# EasyEDA Pro project 01_立创eda专业版_esp32语音助手-自制版_2024-07-09.epro, board PCB3_1
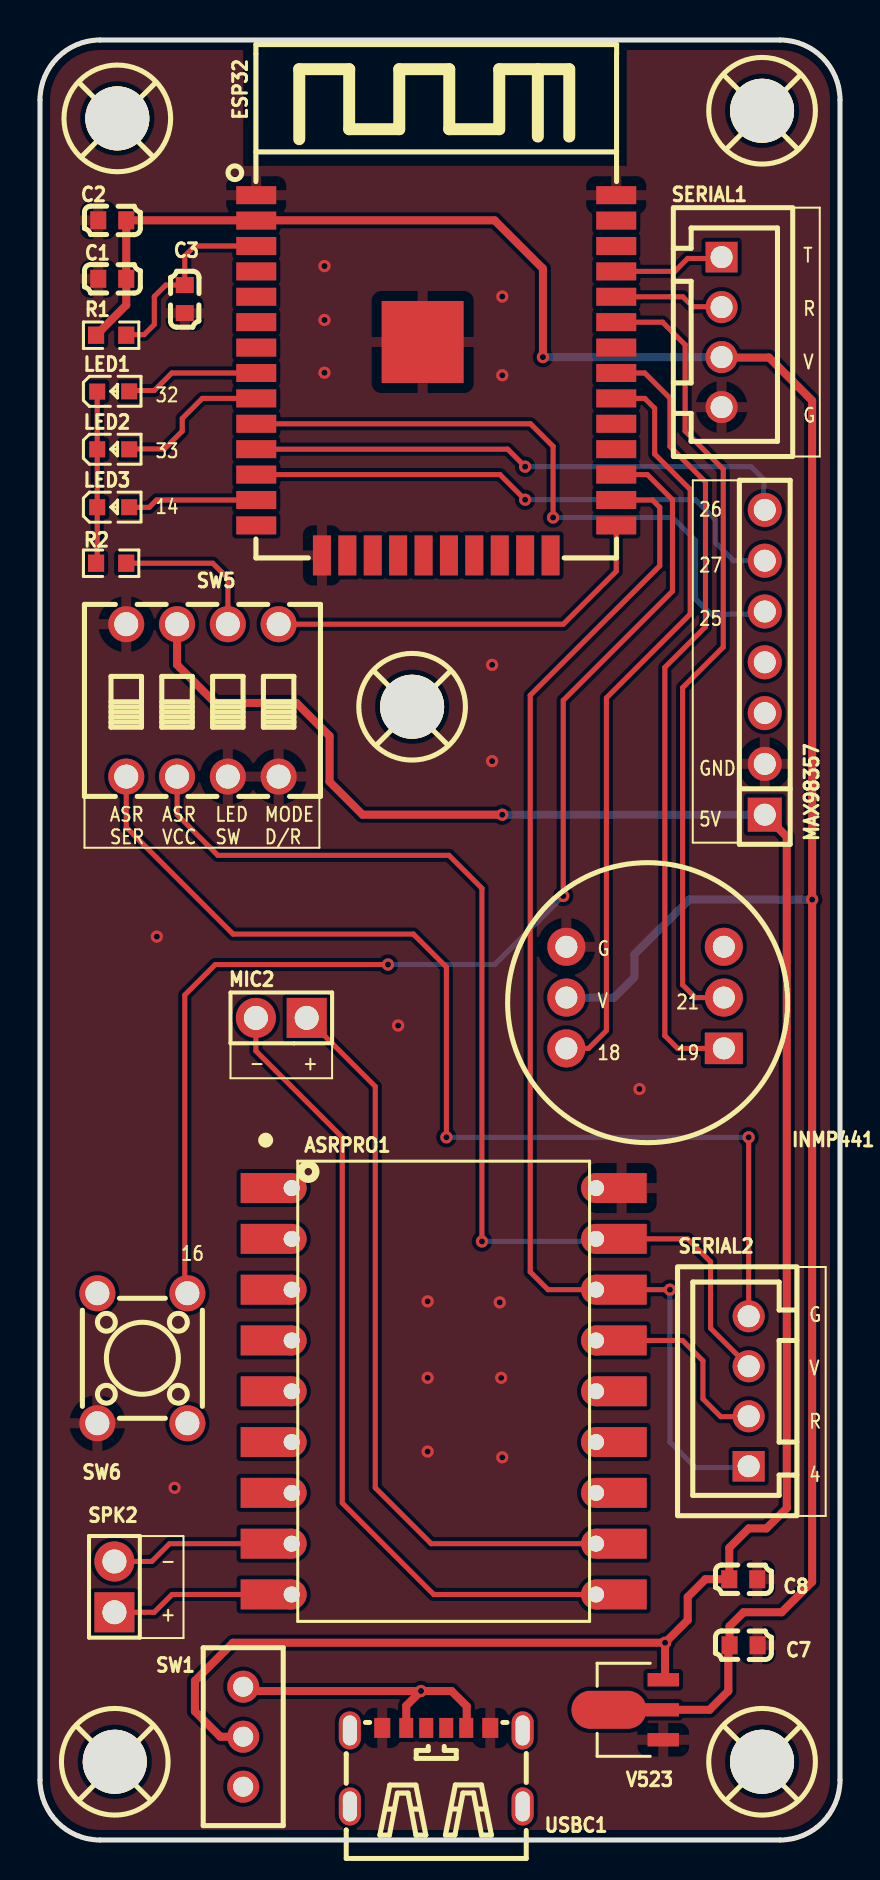
[diagram p16: board, top side]
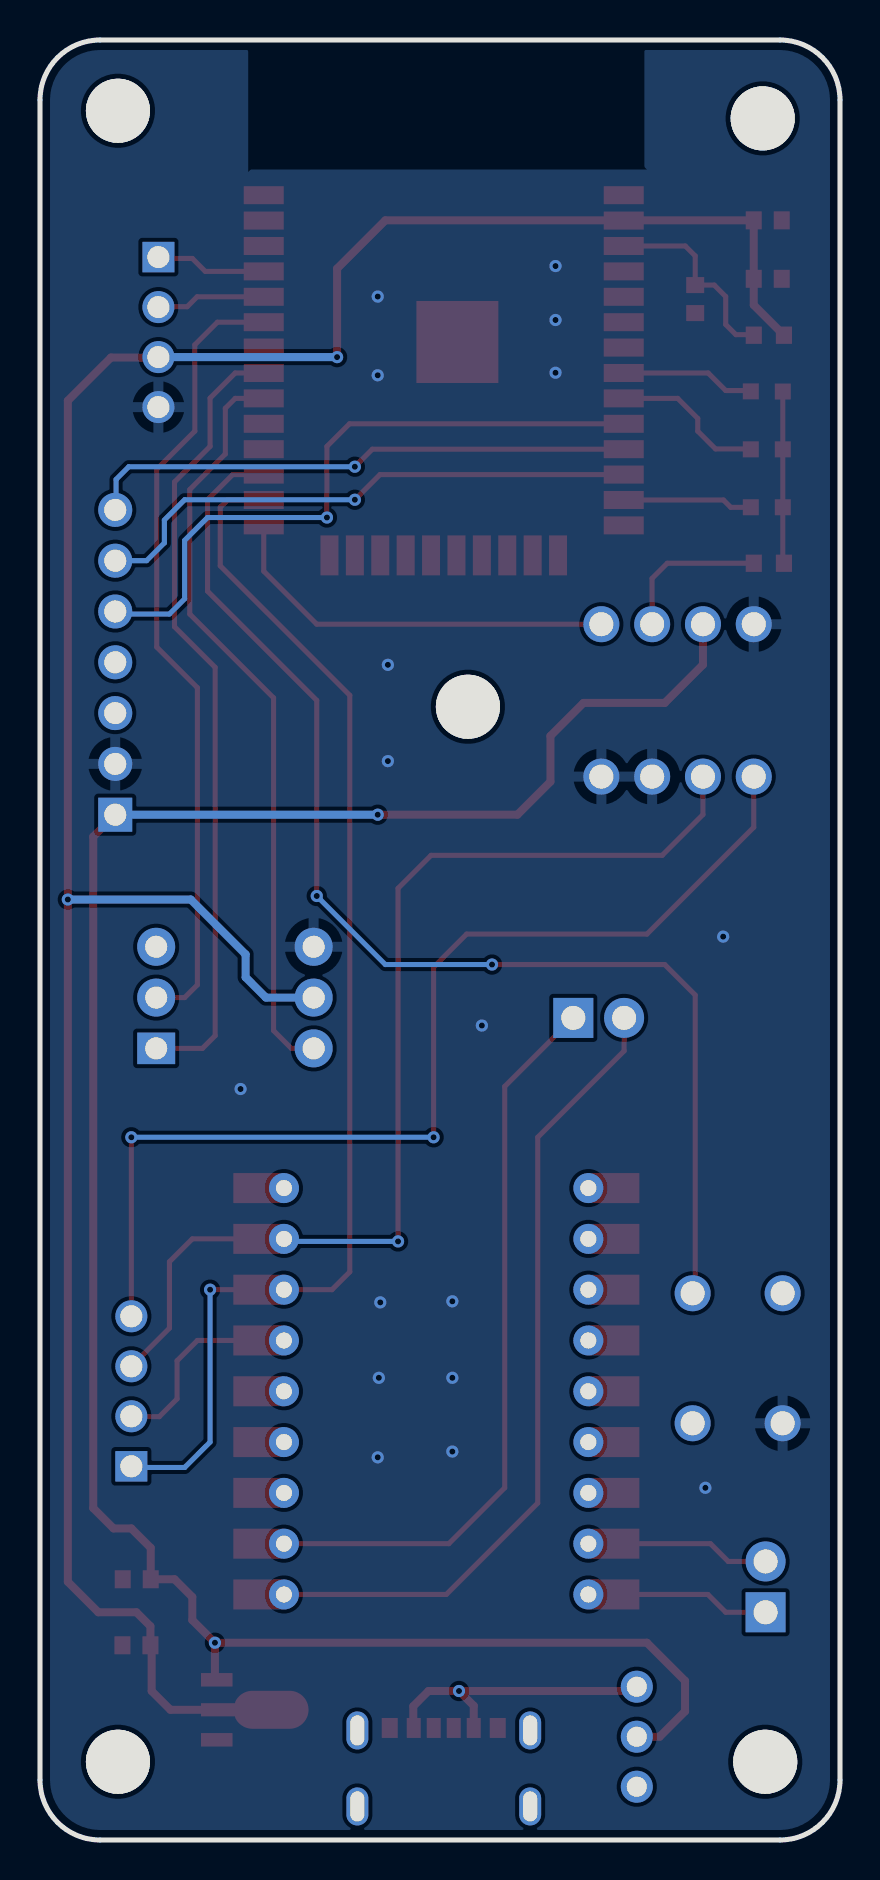
[diagram p17: board, bottom side, seen from below]

Outline 40 x 90 mm; copper layers: Top Layer, Bottom Layer. Coordinates in mm from the lower left corner of the outline.
Outline path: 0,87 0,3 arc(0.88,0.88) 3,0 37,0 arc(39.12,0.88) 40,3 40,87 arc(39.12,89.12) 37,90 3,90 arc(0.88,89.12) 0,87
Stack: Top Layer 0.035mm / Dielectric1 1.51mm FR4 er 4.5 / Bottom Layer 0.035mm

## Design rules (mm)
template: JLCPCB Capability(Two Layers Board)
spacing copperThickness1oz (default): track to track 0.102, other pairs 0.152 to 0.3
spacing copperThickness2oz: track to track 0.203, other pairs 0.152 to 0.3
track width copperThickness1oz (default): min 0.127, default 0.254, max 2.54
track width copperThickness2oz: min 0.203, default 0.254, max 2.54
differential pair differentialPair (default): width min 0.127, default 0.254, max 2.54; gap min 0.152, default 0.152
via viaSize (default): diameter min 0.5, default 0.61, max 10; hole min 0.3, default 0.305, max 6.3

## Placement (name value [footprint] x y rotation side)
ASRPRO1  -  [ASRPRO-CORE]  20.19 22.44 0 top
C1  100nF  [C0603]  3.61 78.06 180 top
C2  10uF  [C0603]  3.61 80.98 180 top
C3  100nF  [C0603]  7.24 77.05 90 top
C7  10uF  [C0603]  35.18 9.74 0 top
C8  10uF  [C0603]  35.16 13.04 180 top
ESP32  ESP32-WROOM-32-N4  [WIFIM-SMD_ESP32-WROOM-32-N4]  19.81 73.24 0 top
INMP441  -  [INMP441]  30.38 41.87 180 top
LED1  NCD0603R1  [LED0603-RD_RED]  3.66 72.43 0 top
LED2  NCD0603G1  [LED0603-RD]  3.66 69.53 0 top
LED3  NCD0603B1  [LED0603-RD]  3.66 66.64 0 top
MAX98357  PZ254V-11-07P  [HDR-TH_7P-P2.54-V-M]  36.24 58.89 90 top
MIC2  PZ254V-11-02P  [HDR-TH_2P-P2.54-V-M]  12.06 41.11 180 top
R1  10kΩ  [R0603]  3.56 75.24 180 top
R2  1kΩ  [R0603]  3.56 63.84 180 top
SCREW1  -  [M3螺丝]  3.93 86.02 0 top
SCREW2  -  [M3螺丝]  36.17 86.4 0 top
SCREW3  -  [M3螺丝]  3.8 3.85 0 top
SCREW4  -  [M3螺丝]  36.17 3.85 0 top
SCREW5  -  [M3螺丝]  18.67 56.6 0 top
SERIAL1  ZX-XH2.54-4PZZ  [CONN-TH_4P-P2.50_4PIN]  34.08 75.39 270 top
SERIAL2  ZX-XH2.54-4PZZ  [CONN-TH_4P-P2.50_4PIN]  35.43 22.44 90 top
SPK2  PZ254V-11-02P  [HDR-TH_2P-P2.54-V-M]  3.72 12.66 90 top
SW1  SS-12D00-G3  [SW-TH_SS-12D00-G3]  10.16 5.16 90 top
SW5  DSWB04LHGET  [SW-TH_DSWB04LHGET]  8.12 56.98 0 top
SW6  TS-1002-07026  [SW-TH_4P-L6.0-W6.0-P4.50-LS6.5]  5.12 24.09 90 top
USBC1  TYPE-C 6P(073)  [TYPE-C-SMD_TYPE-C-6P]  19.81 3.64 0 top
V523  AMS1117-3.3V  [SOT-89-3_L4.5-W2.5-P1.50-LS4.2-BR]  29.81 6.51 0 top

## Footprints (pads in the part's own frame, mm; a bottom-side part is the same pattern mirrored in y, then rotated)
ASRPRO-CORE
  rect 2.5x1.5 smd: 1(-8.91,10.16) 2(-8.91,7.62) 3(-8.91,5.08) 4(-8.91,2.54) 5(-8.91,0) 6(-8.91,-2.54) 7(-8.91,-5.08) 8(-8.91,-7.62) 9(-8.91,-10.16) 10(8.89,-10.16) 11(8.89,-7.62) 12(8.89,-5.08) 13(8.89,-2.54) 14(8.89,0) 15(8.89,2.54) 16(8.89,5.08) 17(8.89,7.62) 18(8.89,10.16)
  round 1.5 hole 0.8: 1(-7.61,10.16) 2(-7.61,7.62) 3(-7.61,5.08) 4(-7.61,2.54) 5(-7.61,0) 6(-7.61,-2.54) 7(-7.61,-5.08) 8(-7.61,-7.62) 9(-7.61,-10.16) 10(7.61,-10.16) 11(7.61,-7.62) 12(7.61,-5.08) 13(7.61,-2.54) 14(7.61,0) 15(7.61,2.54) 16(7.61,5.08) 17(7.61,7.62) 18(7.61,10.16)
C0603
  rect 0.8x0.9 smd: 1(-0.7,0) 2(0.7,0)
CONN-TH_4P-P2.50_4PIN
  rect 1.524x1.6 hole 1.1: 1(-3.75,0)
  round 1.6 hole 1.1: 2(-1.25,0) 3(1.25,0) 4(3.75,0)
HDR-TH_2P-P2.54-V-M
  rect 2x2 hole 1.2: 1(-1.27,0)
  round 2 hole 1.2: 2(1.27,0)
HDR-TH_7P-P2.54-V-M
  rect 1.7x1.7 hole 1.1: 1(-7.62,0)
  round 1.7 hole 1.1: 2(-5.08,0) 3(-2.54,0) 4(0,0) 5(2.54,0) 6(5.08,0) 7(7.62,0)
INMP441
  rect 1.9x1.575 hole 1.1: 1(-3.81,2.286)
  round 1.9 hole 1.1: 2(-3.81,-0.254) 3(-3.81,-2.794) 4(4.064,2.286) 5(4.064,-0.254) 6(4.064,-2.794)
LED0603-RD
  rect 0.8x0.8 smd: 1(-0.799,0) 2(0.799,0)
LED0603-RD_RED
  rect 0.8x0.8 smd: 1(-0.799,-0.004) 2(0.799,0.004)
M3螺丝
  round 3.2 hole 3.2: 1(-0.064,0.064)
R0603
  rect 0.806x0.864 smd: 1(-0.753,0) 2(0.753,0)
SOT-89-3_L4.5-W2.5-P1.50-LS4.2-BR
  rect 1.575x0.672 smd: 1(1.356,-1.5) 3(1.356,1.5)
  custom 5.377x1.9 smd: 2(-1.356,0)
SW-TH_4P-L6.0-W6.0-P4.50-LS6.5
  round 1.8 hole 1.2: 1(-3.25,2.25) 2(3.25,2.25) 3(-3.25,-2.25) 4(3.25,-2.25)
SW-TH_DSWB04LHGET
  round 1.8 hole 1.2: 1(-3.81,3.81) 2(-1.27,3.81) 3(1.27,3.81) 4(3.81,3.81) 5(-3.81,-3.81) 6(-1.27,-3.81) 7(1.27,-3.81) 8(3.81,-3.81)
SW-TH_SS-12D00-G3
  round 1.6 hole 1: 1(-2.5,0) 2(0,0) 3(2.5,0)
TYPE-C-SMD_TYPE-C-6P
  oval 1.1x1.9 hole 0.7x1.5: 7(-4.32,1.837) 7(-4.32,-1.962) 7(4.32,1.837) 7(4.32,-1.962)
  rect 0.7x1 smd: A5(-0.5,1.962) A9(1.5,1.962) B5(0.5,1.962) B9(-1.5,1.962)
  rect 0.8x1 smd: A12(2.7,1.962) B12(-2.7,1.962)
WIFIM-SMD_ESP32-WROOM-32-N4
  rect 2x0.9 smd: 1(-9,9.005) 2(-9,7.735) 3(-9,6.465) 4(-9,5.195) 5(-9,3.925) 6(-9,2.655) 7(-9,1.385) 8(-9,0.115) 9(-9,-1.155) 10(-9,-2.425) 11(-9,-3.695) 12(-9,-4.965) 13(-9,-6.235) 14(-9,-7.505) 25(9,-7.505) 26(9,-6.235) 27(9,-4.965) 28(9,-3.695) 29(9,-2.425) 30(9,-1.155) 31(9,0.115) 32(9,1.385) 33(9,2.655) 34(9,3.925) 35(9,5.195) 36(9,6.465) 37(9,7.735) 38(9,9.005)
  rect 0.9x2 smd: 15(-5.715,-9.005) 16(-4.445,-9.005) 17(-3.175,-9.005) 18(-1.905,-9.005) 19(-0.635,-9.005) 20(0.635,-9.005) 21(1.905,-9.005) 22(3.175,-9.005) 23(4.445,-9.005) 24(5.715,-9.005)
  rect 4.1x4.1 smd: 39(-0.68,1.665)

## Nets
As in the schematic.

Pads without a net: ASRPRO1 1 2 3 4 5 6 7 12 13 14; ESP32 4 5 6 7 14 16 17 18 19 20 21 22 23 24 28 29 32 36 37; INMP441 3; MAX98357 3 4; SCREW1 1; SCREW2 1; SCREW3 1; SCREW4 1; SCREW5 1; SW1 1; SW6 2 3; USBC1 7 A5 B5

## Via types
v1: diameter 0.61, hole 0.305, Top Layer to Bottom Layer, 31 vias

## Routing (per net, layer and track width the routed paths; a pad name or vN(x,y) marks a point on that pad's centre or on a via; arc(x,y) is an arc through that point)
3V3: length 135.7
  Top Layer w0.4: 10.82,80.98 ESP32.2 ; 10.82,80.98 22.73,80.98 25.15,78.57 v1(25.15,74.14) ; 10.82,80.98 C2.1 C1.1 4.31,76.75 R1.2 ; V523.2 33.48,6.51 34.42,7.45 34.42,9.67 C7.1 34.48,10.69 35.18,11.39 37.08,11.39 38.61,12.91 v1(38.61,47.02) 38.61,71.97 36.45,74.12 34.1,74.12 SERIAL1.3
  Bottom Layer w0.4: 26.32,42.12 28.7,42.12 29.72,43.14 29.72,44.28 32.46,47.02 v1(38.61,47.02) ; SERIAL1.3 v1(25.15,74.14)
5V: length 112.1
  Top Layer w0.4: MAX98357.1 37.34,50.17 37.34,16.59 36.32,15.58 35.43,15.58 34.46,14.61 C8.2 33.27,13.04 32.38,12.15 32.38,10.99 v1(31.25,9.86) ; v1(31.25,9.86) 9.65,9.86 7.75,7.96 7.75,6.43 9.02,5.16 SW1.2 ; v1(31.25,9.86) 31.25,8.1 31.16,8.01 ; SW5.2 6.85,58.76 8.76,56.85 12.83,56.85 14.48,55.2 14.48,52.92 16.13,51.27 v1(23.11,51.27)
  Bottom Layer w0.4: v1(23.11,51.27) MAX98357.1
5VIN: length 14.8
  Top Layer w0.4: v1(19.05,7.45) 10.37,7.45 SW1.3 ; v1(19.05,7.45) 20.57,7.45 21.34,6.69 21.34,5.63 USBC1.A9 ; v1(19.05,7.45) 18.31,6.71 USBC1.B9
GND:
  vias: v1(5.84,45.17) v1(6.73,17.61) v1(14.22,78.7) v1(14.22,76) v1(14.22,73.36) v1(17.91,40.72) v1(19.38,26.93) v1(19.38,23.11) v1(19.38,19.42) v1(22.61,58.76) v1(22.61,53.94) v1(22.99,26.88) v1(23.11,77.17) v1(23.11,73.24) v1(23.06,23.11) v1(23.11,19.13) v1(29.97,37.55)
ASRPRO_GND: length 54
  Top Layer w0.254: SW5.5 4.31,50.64 9.65,45.3 18.67,45.3 20.32,43.64 v1(20.32,35.14) ; v1(35.43,35.14) SERIAL2.4
  Bottom Layer w0.254: v1(20.32,35.14) v1(35.43,35.14)
ASRPRO_RX: length 9.1
  Top Layer w0.254: ASRPRO1.15 32.13,24.98 33.15,23.96 33.15,22.06 34.04,21.17 35.41,21.17 SERIAL2.2
ASRPRO_VCC: length 54.3
  Top Layer w0.254: SW5.6 6.85,51.27 8.89,49.23 20.45,49.23 22.1,47.58 v1(22.1,29.93) ; SERIAL2.3 33.53,25.59 33.53,28.91 32.38,30.06 ASRPRO1.17 ASRPRO1.17
  Bottom Layer w0.254: ASRPRO1.17 27.68,29.93 v1(22.1,29.93)
IO0: length 20.3
  Top Layer w0.254: SW5.4 26.16,60.79 28.81,63.44 ESP32.25
IO4: length 61.4
  Top Layer w0.254: ASRPRO1.16 v1(31.5,27.52) ; ESP32.26 30.62,67 30.99,66.63 30.99,63.71 24.51,57.23 24.51,28.41 25.4,27.52 ASRPRO1.16
  Bottom Layer w0.254: SERIAL2.1 35.37,18.63 32.77,18.63 31.5,19.9 v1(31.5,27.52)
IO14: length 6.5
  Top Layer w0.254: ESP32.13 5.83,67 5.46,66.63 4.47,66.63 LED3.2
IO16: length 61.3
  Top Layer w0.254: v1(26.16,47.2) 26.16,56.98 31.62,62.44 31.62,67.01 30.37,68.27 ESP32.27 ; SW6.4 7.24,27.47 7.24,42.25 8.76,43.77 v1(17.4,43.77)
  Bottom Layer w0.254: v1(17.4,43.77) 22.73,43.77 v1(26.16,47.2)
IO18: length 38.1
  Top Layer w0.254: ESP32.30 30.24,72.08 30.73,71.58 30.73,69.3 32.51,67.52 32.51,61.3 28.32,57.11 28.32,40.47 27.43,39.58 INMP441.4
IO19: length 39.9
  Top Layer w0.254: ESP32.31 30.24,73.35 31.5,72.09 31.5,69.68 33.27,67.9 33.27,60.66 31.24,58.63 31.24,40.22 31.88,39.58 INMP441.1
IO21: length 39.9
  Top Layer w0.254: ESP32.33 31.13,75.89 32.26,74.76 32.26,70.44 34.16,68.54 34.16,59.65 32.13,57.61 32.13,42.76 32.77,42.12 34.19,42.12
IO25: length 33.2
  Top Layer w0.254: ESP32.10 24.52,70.81 25.65,69.68 v1(25.65,66.12)
  Bottom Layer w0.254: v1(25.65,66.12) 31.62,66.12 32.77,64.98 32.77,62.06 33.53,61.3 36.11,61.3 36.24,61.42
IO26: length 27.6
  Top Layer w0.254: 10.81,69.54 23.38,69.54 v1(24.26,68.66)
  Bottom Layer w0.254: v1(24.26,68.66) 35.56,68.66 36.19,68.03 36.19,66.55 36.24,66.5
IO27: length 27.9
  Top Layer w0.254: v1(24.26,67.01) 23,68.27 ESP32.12
  Bottom Layer w0.254: v1(24.26,67.01) 32.77,67.01 33.78,66 33.78,64.85 34.67,63.97 MAX98357.6
IO32: length 6.7
  Top Layer w0.254: LED1.2 4.5,72.47 5.72,72.47 6.59,73.35 ESP32.8
IO33: length 7.8
  Top Layer w0.254: LED2.2 4.48,69.55 6.22,69.55 7.11,70.44 7.11,71.08 8.12,72.08 ESP32.9
LED_CTRL: length 7.7
  Top Layer w0.254: SW5.3 9.4,60.8 9.4,63.08 8.64,63.84 R2.1
MIC+: length 37.1
  Top Layer w0.254: ASRPRO1.11 19.56,14.82 16.76,17.61 16.76,37.68 MIC2.1
MIC-: length 40.6
  Top Layer w0.254: ASRPRO1.10 19.69,12.28 15.11,16.85 15.11,35.14 10.79,39.45 MIC2.2
RXD: length 5.5
  Top Layer w0.254: SERIAL1.2 34.06,76.67 32.64,76.67 32.14,77.16 ESP32.34
SPK+: length 7.9
  Top Layer w0.254: ASRPRO1.9 6.6,12.28 5.72,11.39 SPK2.1
SPK-: length 7.9
  Top Layer w0.254: SPK2.2 5.59,13.93 6.48,14.82 ASRPRO1.8
TXD: length 5.6
  Top Layer w0.254: ESP32.35 31.74,78.43 32.38,79.08 34.01,79.08 SERIAL1.1
$1N784: length 10
  Top Layer w0.254: R1.1 4.34,75.27 5.21,75.27 5.72,75.78 5.72,77.17 6.29,77.75 C3.2 7.24,79.2 7.74,79.7 10.81,79.7
$3N1069: length 8.6
  Top Layer w0.254: R2.2 2.86,63.89 LED3.1 LED2.1 ; LED1.1 2.86,69.53

## Copper pours and planes (outline as drawn; the poured copper is in the pictures)
GND on Top Layer: -0.89,91.14 10.16,91.14 10.16,83.7 29.28,83.7 29.34,83.65 29.34,90.89 29.59,91.14 29.84,90.89 40.77,90.89 40.77,0.72 38.35,-1.69 1.91,-1.69 -1.52,1.74 -1.52,90.51
GND on Bottom Layer: -0.63,90.63 9.78,90.63 9.78,83.65 9.65,83.52 29.46,83.52 29.59,83.4 29.59,91.14 29.72,91.27 41.15,91.27 41.15,-0.55 38.48,-3.22 2.03,-3.22 -0.63,-0.55

## Text on the board
Top Silkscreen Layer: ASR / SER | 32 | 33 | 14 | - | + | ASR / VCC | 16 | LED / SW | MODE / D/R | G | V | 18 | 21 | 19 | 26 | 27 | 25 | GND | 5V | T | R | 4
